# EAGLE schematic rpi-header-can-pwr_v2 (EAGLE 7.6.0)

## Sheet 1 of 4
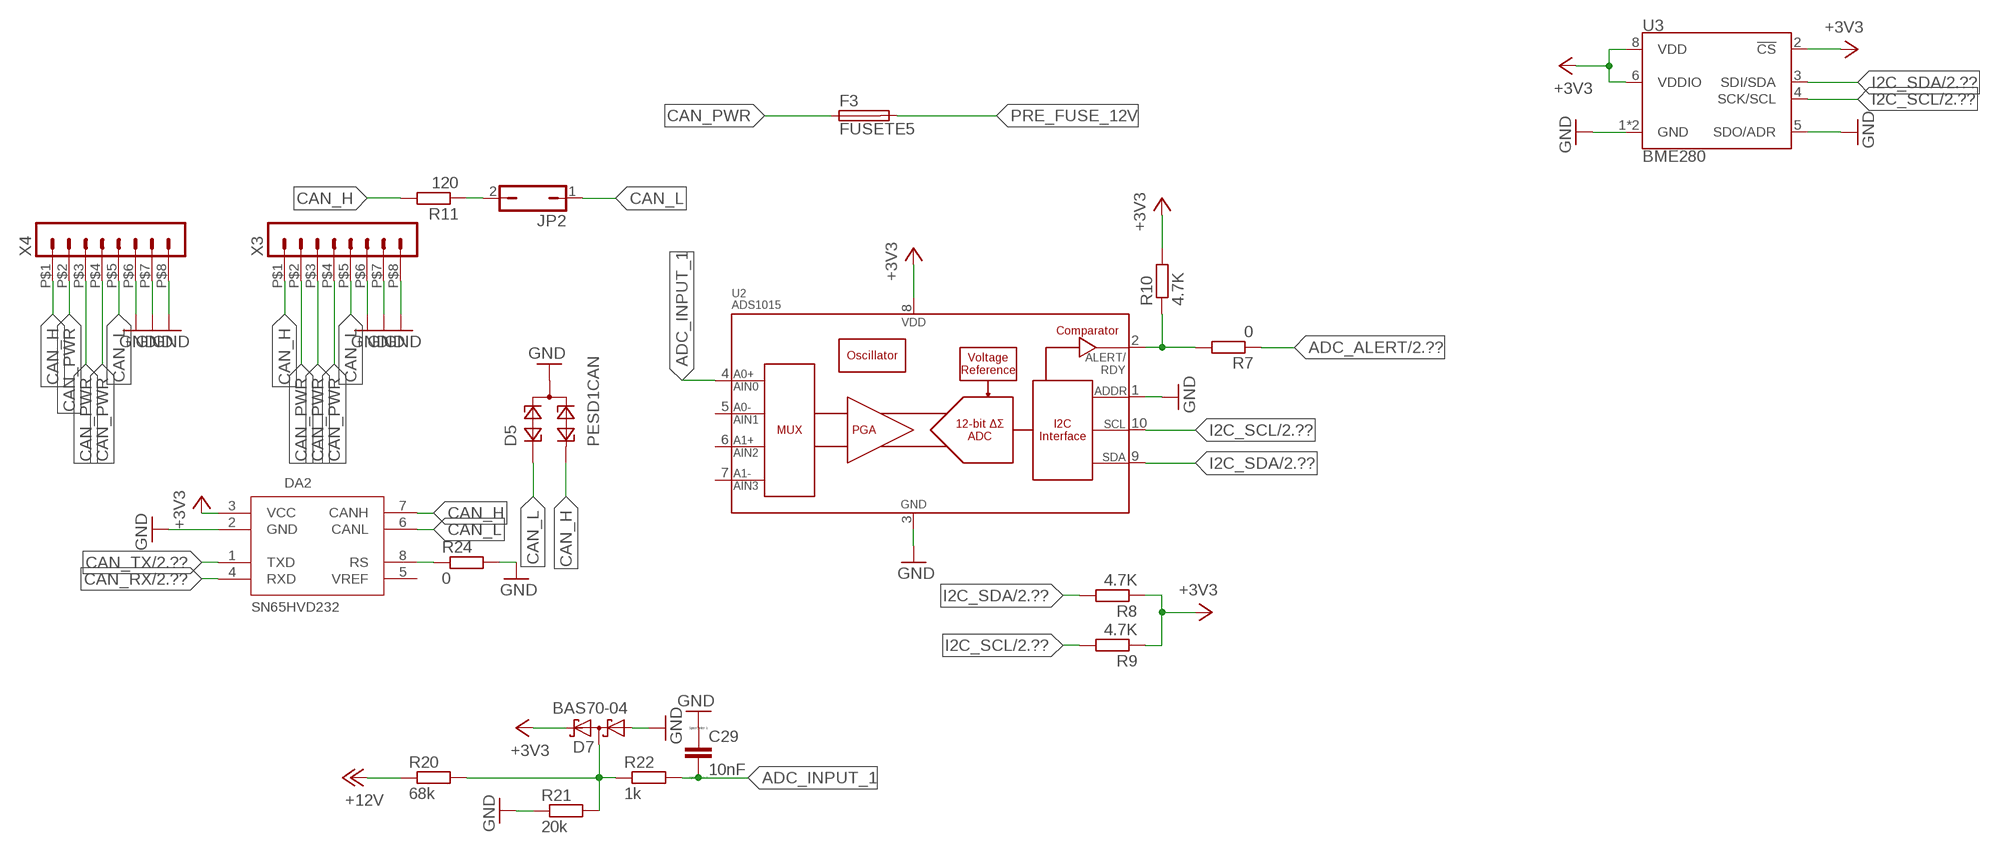
[diagram p0: schematic, sheet 1]

### Parts
C29  10nF  CC0603  [C0603]
D5  PESD1CAN  [SOT23]
D7  BAS70-04  [SOT23]
DA2  SN65HVD232  [SO08]
F3  FUSETE5  [TE5]
JP2  JP1Q  [JP1]
R7  0  R-EU_R0603  [R0603]
R8  4.7K  R-EU_R0603  [R0603]
R9  4.7K  R-EU_R0603  [R0603]
R10  4.7K  R-EU_R0603  [R0603]
R11  120  R-EU_R0603  [R0603]
R20  68k  R-EU_R0603  [R0603]
R21  20k  R-EU_R0603  [R0603]
R22  1k  R-EU_R0603  [R0603]
R24  0  R-EU_R0603  [R0603]
U2  ADS1015  [MSOP10]
U3  BME280  [LGA-8-2.5X2.5]
X3  HEADER_POS8_43045-0812  [43045-0812]
X4  HEADER_POS8_43045-0812  [43045-0812]

### Nets
12V_REFERENCE4: D7.3(C1A2) R20.2 R21.2 R22.1
+3V3: D7.2(C2) DA2.3(VCC) R8.1 R9.1 R10.2 U2.8(VDD) U3.2(!CS) U3.6(VDDIO) U3.8(VDD) ; also sheet 2,4
+12V: R20.1 ; also sheet 3
ADC_ALERT: R7.1 ; also sheet 2
ADC_INPUT_1: C29.2 R22.2 U2.4(AIN0)
CAN_H: D5.2 DA2.7(CANH) R11.2 X3.P$1 X4.P$1
CAN_L: D5.1 DA2.6(CANL) JP2.1 X3.P$5 X4.P$5
CAN_PWR: F3.1 X3.P$2 X3.P$3 X3.P$4 X4.P$2 X4.P$3 X4.P$4
CAN_RX: DA2.4(RXD) ; also sheet 2
CAN_TX: DA2.1(TXD) ; also sheet 2
GND: C29.1 D5.3 D7.1(A1) DA2.2(GND) R21.1 R24.2 U2.1(ADDR) U2.3(VSS) U3.1(GND) U3.5(SDO/ADR) U3.7(GND) X3.P$6 X3.P$7 X3.P$8 X4.P$6 X4.P$7 X4.P$8 ; also sheet 2,3,4
I2C_SCL: R9.2 U2.10(SCL) U3.4(SCK/SCL) ; also sheet 2
I2C_SDA: R8.2 U2.9(SDA) U3.3(SDI/SDA) ; also sheet 2
N$9: R7.2 R10.1 U2.2(ALERT/RDY)
N$12: JP2.2 R11.1
N$17: DA2.8(RS) R24.1
PRE_FUSE_12V: F3.2 ; also sheet 3
Unconnected: DA2.5(VREF) U2.5(AIN1) U2.6(AIN2) U2.7(AIN3)

## Sheet 2 of 4
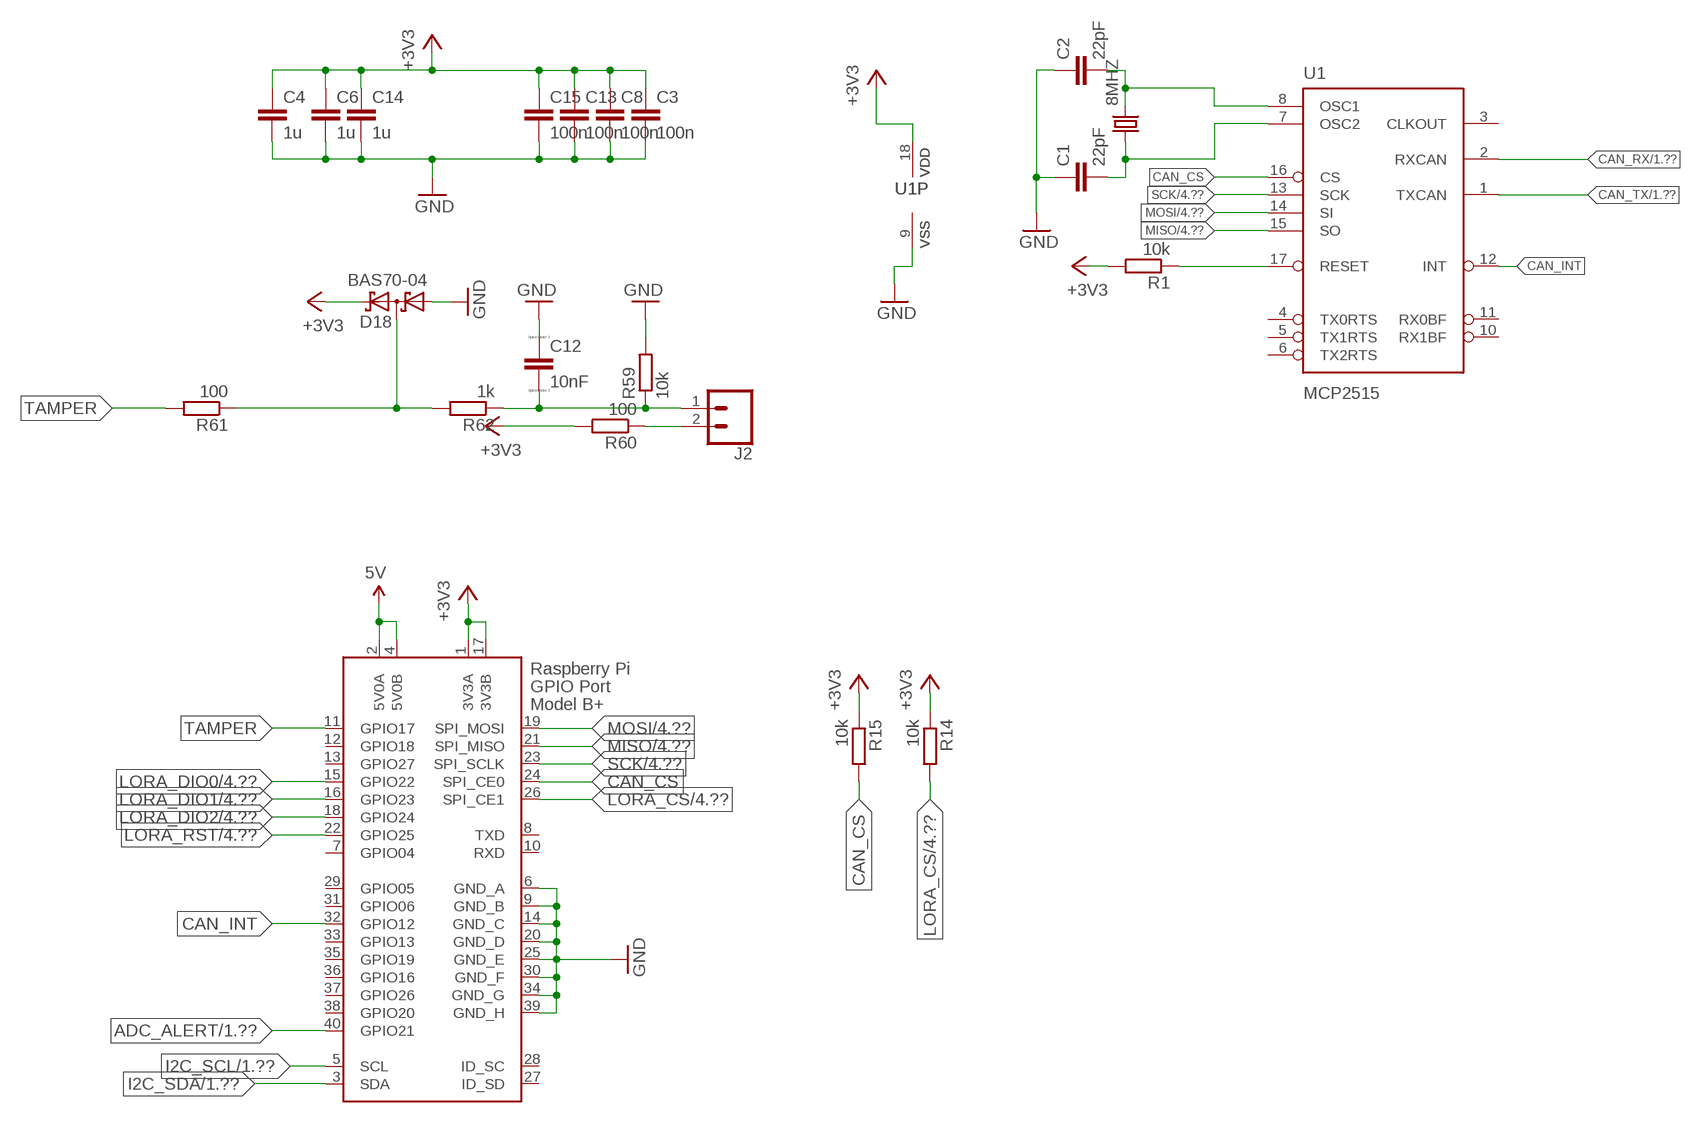
[diagram p1: schematic, sheet 2]

### Parts
8MHZ  CRYSTALHC49UP  [HC49UP]
C1  22pF  22PF-50V-5%(0603)  [0603-CAP]
C2  22pF  22PF-50V-5%(0603)  [0603-CAP]
C3  100n  C-EUC0603  [C0603]
C4  1u  C-EUC0603  [C0603]
C6  1u  C-EUC0603  [C0603]
C8  100n  C-EUC0603  [C0603]
C12  10nF  CC0603  [C0603]
C13  100n  C-EUC0603  [C0603]
C14  1u  C-EUC0603  [C0603]
C15  100n  C-EUC0603  [C0603]
D18  BAS70-04  [SOT23]
J2  CONN_023.5MM  [SCREWTERMINAL-3.5MM-2]
R1  10k  R-EU_R0603  [R0603]
R14  10k  R-EU_R0603  [R0603]
R15  10k  R-EU_R0603  [R0603]
R59  10k  R-EU_R0603  [R0603]
R60  100  R-EU_R0603  [R0603]
R61  100  R-EU_R0603  [R0603]
R62  1k  R-EU_R0603  [R0603]
U1  MCP2515  MCP2510SO  [SO-18W]
X2  RASPI_BOARD_B+#_E3  [RASPI_BOARD_B+_EDGES_3DRILL]

### Nets
5V: X2.2(5V0A) X2.4(5V0B) ; also sheet 3
+3V3: C3.1 C4.1 C6.1 C8.1 C13.1 C14.1 C15.1 D18.2(C2) R1.2 R14.1 R15.1 R60.2 U1.18(VDD) X2.1(3V3A) X2.17(3V3B) ; also sheet 1,4
ADC_ALERT: X2.40(GPIO21) ; also sheet 1
ASDASD: D18.3(C1A2) R61.1 R62.2
CAN_CS: R15.2 U1.16(CS) X2.24(SPI_CE0)
CAN_INT: U1.12(INT) X2.32(GPIO12)
CAN_RX: U1.2(RXCAN) ; also sheet 1
CAN_TX: U1.1(TXCAN) ; also sheet 1
GND: C1.1 C2.1 C3.2 C4.2 C6.2 C8.2 C12.1 C13.2 C14.2 C15.2 D18.1(A1) R59.2 U1.9(VSS) X2.6(GND_A) X2.9(GND_B) X2.14(GND_C) X2.20(GND_D) X2.25(GND_E) X2.30(GND_F) X2.34(GND_G) X2.39(GND_H) ; also sheet 1,3,4
I2C_SCL: X2.5(SCL) ; also sheet 1
I2C_SDA: X2.3(SDA) ; also sheet 1
LORA_CS: R14.2 X2.26(SPI_CE1) ; also sheet 4
LORA_DIO0: X2.15(GPIO22) ; also sheet 4
LORA_DIO1: X2.16(GPIO23) ; also sheet 4
LORA_DIO2: X2.18(GPIO24) ; also sheet 4
LORA_RST: X2.22(GPIO25) ; also sheet 4
MISO: U1.15(SO) X2.21(SPI_MISO) ; also sheet 4
MOSI: U1.14(SI) X2.19(SPI_MOSI) ; also sheet 4
N$2: 8MHZ.2 C2.2 U1.8(OSC1)
N$3: 8MHZ.1 C1.2 U1.7(OSC2)
N$10: J2.2 R60.1
N$11: C12.2 J2.1 R59.1 R62.1
RS: R1.1 U1.17(RESET)
SCK: U1.13(SCK) X2.23(SPI_SCLK) ; also sheet 4
TAMPER: R61.2 X2.11(GPIO17)
Unconnected: U1.3(CLKOUT) U1.4(TX0RTS) U1.5(TX1RTS) U1.6(TX2RTS) U1.10(RX1BF) U1.11(RX0BF) X2.7(GPIO04) X2.8(TXD) X2.10(RXD) X2.12(GPIO18) X2.13(GPIO27) X2.27(ID_SD) X2.28(ID_SC) X2.29(GPIO05) X2.31(GPIO06) X2.33(GPIO13) X2.35(GPIO19) X2.36(GPIO16) X2.37(GPIO26) X2.38(GPIO20)

## Sheet 3 of 4
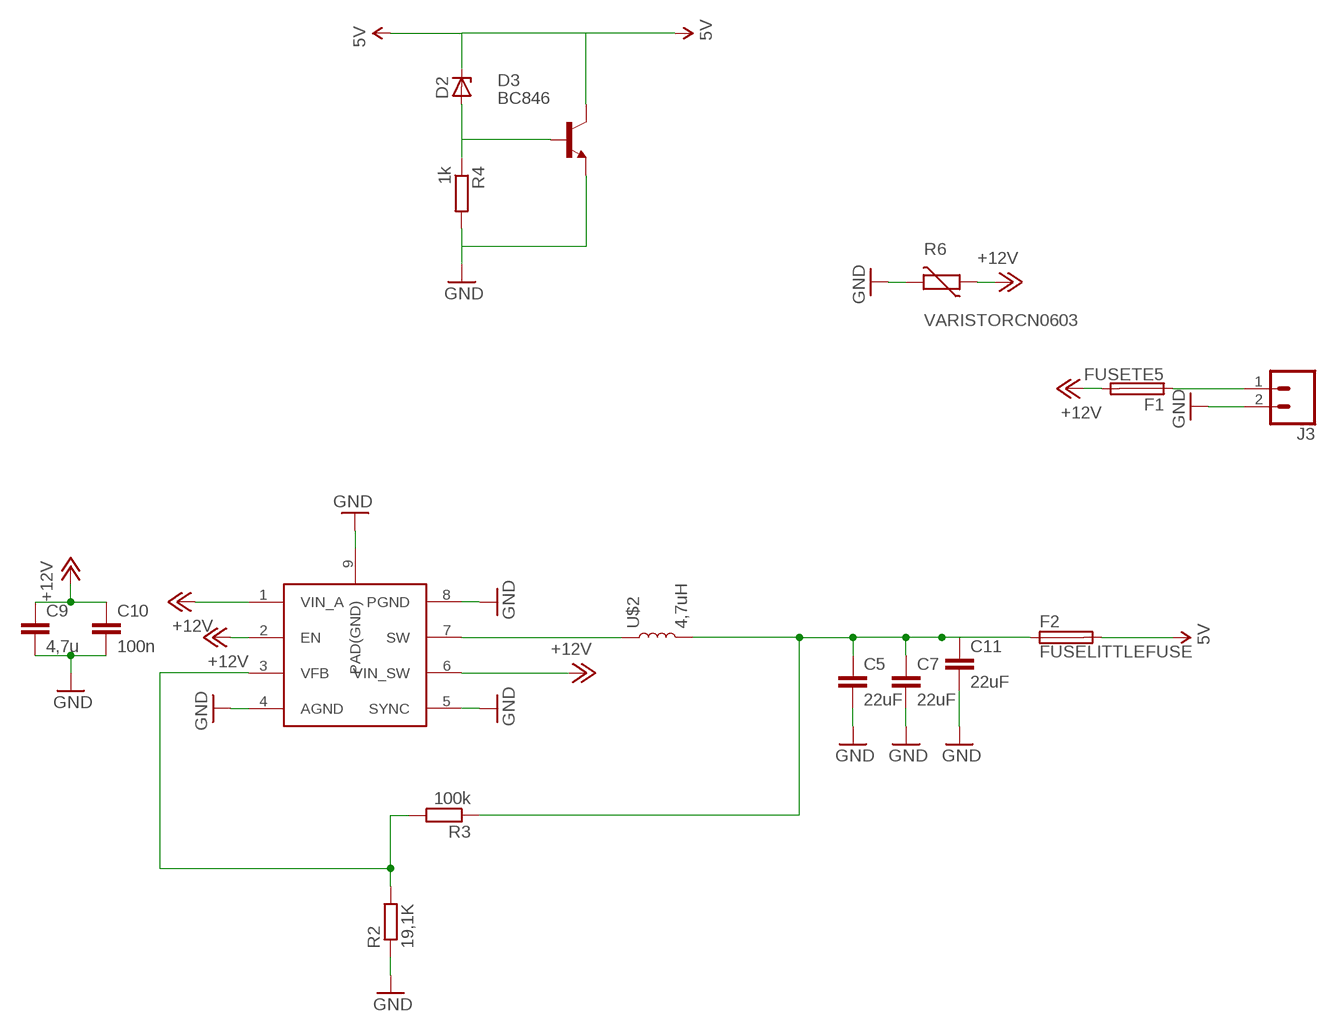
[diagram p2: schematic, sheet 3]

### Parts
C5  22uF  C-EUC1206  [C1206]
C7  22uF  C-EUC1206  [C1206]
C9  4,7u  C-EUC0805  [C0805]
C10  100n  C-EUC0805  [C0805]
C11  22uF  C-EUC1206  [C1206]
D2  ZENER-DIODESOD80C  [SOD80C]
D3  BC846  [SOT23]
F1  FUSETE5  [TE5]
F2  FUSELITTLEFUSE  [LITTLEFUSE]
J3  CONN_025MM  [SCREWTERMINAL-5MM-2]
R2  19,1K  R-EU_R0603  [R0603]
R3  100k  R-EU_R0603  [R0603]
R4  1k  R-EU_R0603  [R0603]
R6  VARISTORCN0603  [CT/CN0603]
U$1  ST1S10  [POWERSO-8]
U$2  4,7uH  PCD0504MT4R7  [0504]

### Nets
5V: D2.C D3.3(C) F2.2 ; also sheet 2
+12V: C9.1 C10.1 F1.2 R6.1 U$1.1(VIN_A) U$1.2(EN) U$1.6(VIN_SW) ; also sheet 1
GND: C5.2 C7.2 C9.2 C10.2 C11.2 D3.2(E) J3.2 R2.1 R4.2 R6.2 U$1.4(AGND) U$1.5(SYNC) U$1.8(PGND) U$1.9(PAD(GND)) ; also sheet 1,2,4
N$1: R2.2 R3.2 U$1.3(VFB)
N$4: D2.A D3.1(B) R4.1
N$7: U$1.7(SW) U$2.1
N$8: C5.1 C7.1 C11.1 F2.1 R3.1 U$2.2
PRE_FUSE_12V: F1.1 J3.1 ; also sheet 1

## Sheet 4 of 4
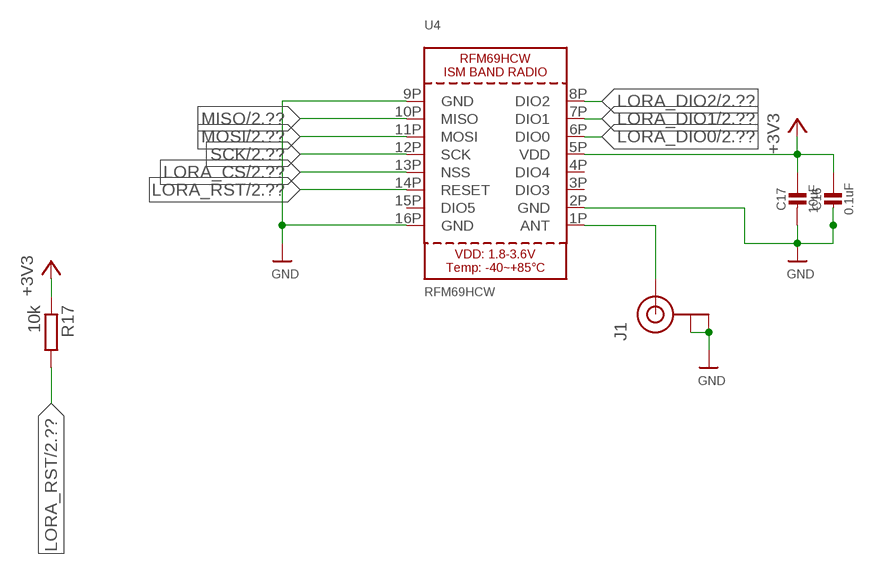
[diagram p3: schematic, sheet 4]

### Parts
C16  0.1uF  CAP_CERAMIC0603_NO  [0603-NO]
C17  10uF  CAP_CERAMIC0805-NOOUTLINE  [0805-NO]
J1  U.FL  [U.FL]
R17  10k  R-EU_R0603  [R0603]
U4  RFM69HCW  RFM69HCW_SMT  [RFMHCW_SMT]

### Nets
+3V3: C16.1 C17.1 R17.1 U4.5P(VDD) ; also sheet 1,2
GND: C16.2 C17.2 J1.P$1(GND) J1.P$2(GND) U4.2P(GND) U4.9P(GND) U4.16P(GND) ; also sheet 1,2,3
LORA_CS: U4.13P(NSS) ; also sheet 2
LORA_DIO0: U4.6P(DIO0) ; also sheet 2
LORA_DIO1: U4.7P(DIO1) ; also sheet 2
LORA_DIO2: U4.8P(DIO2) ; also sheet 2
LORA_RST: R17.2 U4.14P(RESET) ; also sheet 2
MISO: U4.10P(MISO) ; also sheet 2
MOSI: U4.11P(MOSI) ; also sheet 2
N$5: J1.P$3(SIGNAL) U4.1P(ANT)
SCK: U4.12P(SCK) ; also sheet 2
Unconnected: U4.3P(DIO3) U4.4P(DIO4) U4.15P(DIO5)

## Library data of the parts
8MHZ = crystal:CRYSTAL: CRYSTAL; OC_FARNELL: unknown; OC_NEWARK: unknown
C1 C2 = SparkFun-Capacitors:22PF-50V-5%(0603): CAP-07876; PROD_ID: CAP-07876
C3-C11 C13-C15 = rcl:C-EU: CAPACITOR, European symbol
C12 C29 = eagle-ltspice:C: CAPACITOR, European symbol; SPICEMODEL: NONE; SPICEPREFIX: C
C16 C17 = microbuilder:CAP_CERAMIC: Ceramic Capacitors For new designs, use the packages preceded by an '_' character since they are more reliable: The following footprints should be used on most boards: _0402 - Standard footprint for regular board layouts _0603 - Standard footprint for regular board layouts _0805 - Standard footprint for regular board layouts _1206 - Standard footprint for regular board layouts For extremely tight-pitch boards where space is at a premium, the following 'micro-pitch' footprints can be used (smaller pads, no silkscreen outline, etc.): _0402MP - Micro-pitch footprint for very dense/compact boards _0603MP - Micro-pitch footprint for very dense/compact boards _0805MP - Micro-pitch footprint for very dense/compact boards _1206MP - Micro-pitch footprint for very dense/compact boards
D2 = diode:ZENER-DIODE: Z-Diode
D3 = transistor:BC846: NPN TRANSISTOR
D5 = diode:PESD1CAN: CAN bus ESD protection diode Source: http://www.nxp.com/documents/data_sheet/PESD1CAN.pdf
D7 D18 = diode:BAS70-04: Silicon Schottky Diodes General-purpose diode for high-speed switching
DA2 = transceiver:SN65HVD232: CAN TRANSCEIVER
F1-F3 = fuse:FUSE: Fuse; OC_FARNELL: unknown; OC_NEWARK: unknown
J1 = SparkFun-Connectors:U.FL: SMD Antenna Connector - U.FL 2mm height, 3.0mm x 3.0mm receptacle size. SparkFun Products: SparkFun WiFi Shield - ESP8266 <https://www.sparkfun.com/products/13287> SparkFun ESP8266 Thing <https://www.sparkfun.com/products/13231> SparkFun MiniGen - Pro Mini Signal Generator Shield <https://www.sparkfun.com/products/11420>; PROD_ID: CONN-09193; SF_ID: WRL-09144
J2 = SparkFun-Connectors:CONN_02: Multi connection point. Often used as Generic Header-pin footprint for 0.1 inch spaced/style header connections On any of the 0.1 inch spaced packages, you can populate with these: Break Away Headers - Straight <https://www.sparkfun.com/products/116> (PRT-00116) Break Away Male Headers - Right Angle <https://www.sparkfun.com/products/553> (PRT-00553) Female Headers <https://www.sparkfun.com/products/115> (PRT-00115) Break Away Headers - Machine Pin <https://www.sparkfun.com/products/117> (PRT-00117) Break Away Female Headers - Swiss Machine Pin <https://www.sparkfun.com/products/743> (PRT-00743) For SCREWTERMINALS and SPRING TERMINALS visit here: Screw Terimnals on SparkFun.com <https://www.sparkfun.com/search/results?term=Screw+Terminals> (5mm/3.5mm/2.54mm spacing) This device is also useful as a general connection point to wire up your design to another part of your project. Our various solder wires solder well into these plated through hole pads. Hook-Up Wire - Assortment (Stranded, 22 AWG) <https://www.sparkfun.com/products/11375> (PRT-11375) Hook-Up Wire - Assortment (Solid Core, 22 AWG) <https://www.sparkfun.com/products/11367> (PRT-11367) View the entire wire category on our website here <https://www.sparkfun.com/categories/141> Special notes: Molex polarized connector foot print use with: PRT-08233 with associated crimp pins and housings. 2.54_SCREWTERM for use with PRT-10571. 3.5mm Screw Terminal footprints for PRT-08084 5mm Screw Terminal footprints for use with PRT-08432; PROD_ID: CONN-08399
J3 = SparkFun-Connectors:CONN_02: Multi connection point. Often used as Generic Header-pin footprint for 0.1 inch spaced/style header connections On any of the 0.1 inch spaced packages, you can populate with these: Break Away Headers - Straight <https://www.sparkfun.com/products/116> (PRT-00116) Break Away Male Headers - Right Angle <https://www.sparkfun.com/products/553> (PRT-00553) Female Headers <https://www.sparkfun.com/products/115> (PRT-00115) Break Away Headers - Machine Pin <https://www.sparkfun.com/products/117> (PRT-00117) Break Away Female Headers - Swiss Machine Pin <https://www.sparkfun.com/products/743> (PRT-00743) For SCREWTERMINALS and SPRING TERMINALS visit here: Screw Terimnals on SparkFun.com <https://www.sparkfun.com/search/results?term=Screw+Terminals> (5mm/3.5mm/2.54mm spacing) This device is also useful as a general connection point to wire up your design to another part of your project. Our various solder wires solder well into these plated through hole pads. Hook-Up Wire - Assortment (Stranded, 22 AWG) <https://www.sparkfun.com/products/11375> (PRT-11375) Hook-Up Wire - Assortment (Solid Core, 22 AWG) <https://www.sparkfun.com/products/11367> (PRT-11367) View the entire wire category on our website here <https://www.sparkfun.com/categories/141> Special notes: Molex polarized connector foot print use with: PRT-08233 with associated crimp pins and housings. 2.54_SCREWTERM for use with PRT-10571. 3.5mm Screw Terminal footprints for PRT-08084 5mm Screw Terminal footprints for use with PRT-08432; SF_SKU: PRT-08432
JP2 = jumper:JP1Q: JUMPER
R1-R4 R11 R14 R15 R17 R20-R22 R24 R59-R62 = rcl:R-EU_: RESISTOR, European symbol
R6 = varistor:VARISTOR: VARISTOR
R7-R10 = resistor:R-EU_: RESISTOR, European symbol
U1 = SparkFun-DigitalIC:MCP2510: CAN controller with SPI interface to any MCU. Original design by Microchip.; PROD_ID: IC-09906
U2 = SparkFun-IC-Conversion:ADS1015: ADS1015 12-BIT ADC 12-Bit Del-Sig ADC Four single-ended inputs or two differential inputs Internal PGA I2C interface 2.0-5.5V SparkFun Products SparkFun Block for Intel Edison - ADC <https://www.sparkfun.com/products/13770> (DEV-13770); PROD_ID: IC-12270
U3 = SparkFun-Sensors:BME280: Bosch BME280 – Combined Humidity and Pressure Sensor The BME280 is as combined digital humidity, pressure and temperature sensor based on proven sensing principles. The sensor module is housed in an extremely compact metal-lid LGA package with a footprint of only 2.5×2.5mm² with a height of 0.93mm. Its small dimensions and its low power consumption allow the implementation in battery driven devices such as handsets, GPS modules or watches. Datasheet <https://cdn.sparkfun.com/assets/learn_tutorials/4/1/9/BST-BME280_DS001-10.pdf> SparkFun Products SparkFun Atmospheric Sensor Breakout - BME280 <https://www.sparkfun.com/products/13676> (SEN-13676); PROD_ID: IC-13090
U4 = microbuilder:RFM69HCW: RFM69HCW - ISM Band RF Transceiver
U$1 = lcd:ST1S10
U$2 = lcd:PCD0504MT4R7
X2 = raspberrypi_bastelstube_v13:RASPI_BOARD_B+#: Raspberry Pi GPIO connector with markings for the outer dimensions of the Raspberry Pi board model B+ with different sets of drill holes or mounting pads All pins connected
X3 X4 = con-molex-micro-fit-3_0:HEADER_POS8_?: Molex - Micro-Fit 3.0 Series connector, 3.00mm (0.118") pitch header, 8 positions.